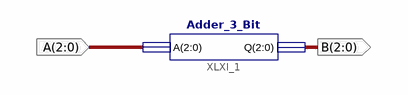
[diagram p0: schematic sheet 1]
// Xilinx ISE schematic Bit3Adder.sch (spartan3e) as structural Verilog: 1 symbols, 2 ports
module Bit3Adder (
  input  [2:0] A,
  output [2:0] B
);

  Adder_3_Bit XLXI_1 (.A(A), .Q(B));
endmodule
